# Altium schematic sheet bqZUM_Bluetooth.SchDoc: Bluetooth
size A4; Author: bq; CompanyName: bq - Mundo Reader; Organization: bq - Mundo Reader; DocumentNumber: 7; Revision: 0; SheetNumber: 7; SheetTotal: 8
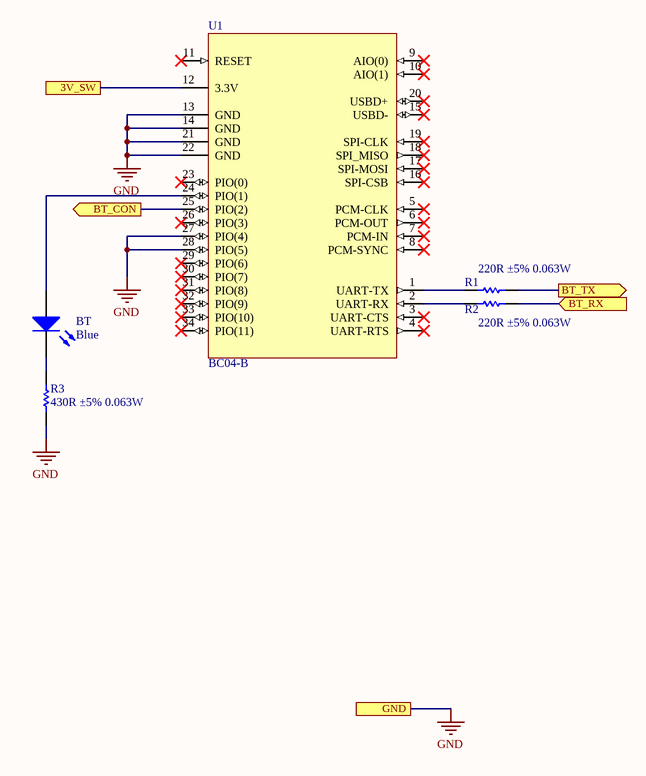
[diagram p0: bqZUM_Bluetooth.SchDoc]

## Parts
BT  Blue  [LED0603]
R1  value 220R ±5% 0.063W  [R0402]  (hidden comment: Resistor)
R2  value 220R ±5% 0.063W  [R0402]  (hidden comment: Resistor)
R3  value 430R ±5% 0.063W  [R0402]  (hidden comment: Resistor)
U1  BC04-B  [BC04-B]

## Ports
3V_SW, BT_CON (out), BT_RX (in), BT_TX (out), GND

## Nets
GND: R3.1 U1.13(GND) U1.14(GND) U1.21(GND) U1.22(GND) U1.27(PIO(4)) U1.28(PIO(5)) ; port GND
3V_SW: U1.12(3.3V) ; port 3V_SW
BT_CON: U1.25(PIO(2)) ; port BT_CON
BT_RX: R2.2 ; port BT_RX
BT_TX: R1.2 ; port BT_TX
NetBT_A: BT.A U1.24(PIO(1))
NetBT_K: BT.K R3.2
NetR1_1: R1.1 U1.1(UART-TX)
NetR2_1: R2.1 U1.2(UART-RX)

Not connected (* = marked no-connect by the designer): U1 3(UART-CTS)* 4(UART-RTS)* 5(PCM-CLK)* 6(PCM-OUT)* 7(PCM-IN)* 8(PCM-SYNC)* 9(AIO(0))* 10(AIO(1))* 11(RESET)* 15(USBD-)* 16(SPI-CSB)* 17(SPI-MOSI)* 18(SPI_MISO)* 19(SPI-CLK)* 20(USBD+)* 23(PIO(0))* 26(PIO(3))* 29(PIO(6))* 30(PIO(7))* 31(PIO(8))* 32(PIO(9))* 33(PIO(10))* 34(PIO(11))*

## Notes on the sheet
- Title
- Project
- Size:
- Author
- A4
- Number:
- Revision:
- Date:
- Time:
- Sheet
- of

## Library data of the parts
BT = LTST-C194TBKT: Light Emitting Diode; Manufacturer: Lite-On; Temp_ Max: 80; Temp_ Min: -20; Part Number: LTST-C194TBKT; OrderingCode: LTST-C194TBKT; Value: Blue
R1 R2 = R0402_220R_0.063W_±5%: Manufacturer: Vishay; Tolerance: ±5%; OrderingCode: CRCW0402220RJN; Power: 0.063W; Resistance: 220R; Temp_ Max: 155; Temp_ Min: -55; PackageDescription: SMD; Part Number: R0402_220R_0.063W_±5%
R3 = R0402_430R_0.063W_±5%: Manufacturer: Vishay; Tolerance: ±5%; OrderingCode: CRCW0402430RJN; Power: 0.063W; Resistance: 430R; Temp_ Max: 155; Temp_ Min: -55; PackageDescription: SMD; Part Number: R0402_430R_0.063W_±5%
U1 = BC04-B: BC04-B Bluetooth module; Manufacturer: Bolutek; OrderingCode: BLK-MD-BC04-B; Temp_ Max: 55; Temp_ Min: -20; Part Number: BC04-B; Supplier: Bolutek; Value: BC04-B